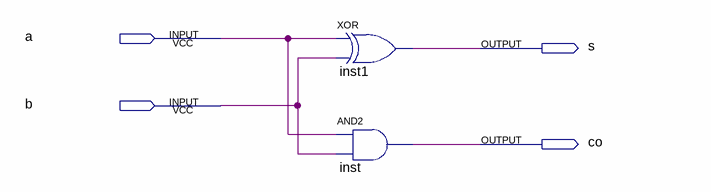
[diagram p0: schematic sheet]
// Quartus schematic abk_ha.bdf as structural Verilog: 2 symbols, 4 pins
module abk_ha (
  input  a,
  input  b,
  output s,
  output co
);

  xor inst1 (s, a, b);
  and inst (co, a, b);
endmodule
